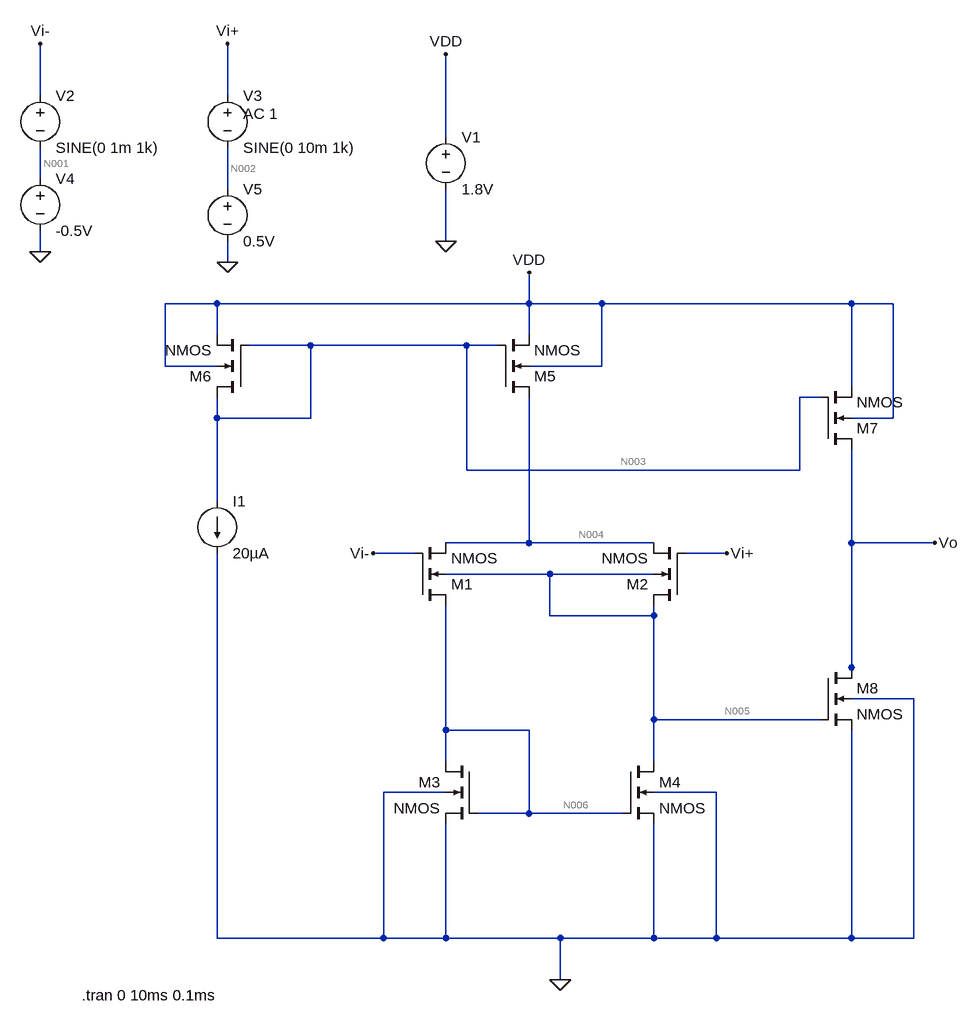
[diagram p0: schematic LAB3.asc]
LAB3.asc, the LTspice schematic file:
Version 4.1
SHEET 1 1288 1304
WIRE -160 -96 -160 -176
WIRE 128 -96 128 -176
WIRE 464 -32 464 -160
WIRE -160 32 -160 -16
WIRE 128 48 128 -16
WIRE 464 128 464 48
WIRE -160 144 -160 112
WIRE 128 160 128 128
WIRE 112 224 32 224
WIRE 592 224 592 176
WIRE 592 224 112 224
WIRE 704 224 592 224
WIRE 1088 224 704 224
WIRE 1152 224 1088 224
WIRE 112 272 112 224
WIRE 592 272 592 224
WIRE 256 288 160 288
WIRE 496 288 256 288
WIRE 544 288 496 288
WIRE 32 320 32 224
WIRE 112 320 32 320
WIRE 704 320 704 224
WIRE 704 320 592 320
WIRE 1088 352 1088 224
WIRE 1040 368 1008 368
WIRE 112 400 112 368
WIRE 256 400 256 288
WIRE 256 400 112 400
WIRE 1152 400 1152 224
WIRE 1152 400 1088 400
WIRE 496 480 496 288
WIRE 1008 480 1008 368
WIRE 1008 480 496 480
WIRE 112 528 112 400
WIRE 592 592 592 368
WIRE 592 592 464 592
WIRE 784 592 592 592
WIRE 1088 592 1088 448
WIRE 1216 592 1088 592
WIRE 416 608 352 608
WIRE 896 608 832 608
WIRE 624 640 464 640
WIRE 784 640 624 640
WIRE 624 704 624 640
WIRE 784 704 784 688
WIRE 784 704 624 704
WIRE 1088 784 1088 592
WIRE 1088 800 1088 784
WIRE 1184 832 1088 832
WIRE 784 864 784 704
WIRE 1040 864 784 864
WIRE 464 880 464 688
WIRE 592 880 464 880
WIRE 464 928 464 880
WIRE 784 928 784 864
WIRE 464 976 368 976
WIRE 880 976 784 976
WIRE 592 1008 592 880
WIRE 592 1008 512 1008
WIRE 736 1008 592 1008
WIRE 112 1200 112 608
WIRE 368 1200 368 976
WIRE 368 1200 112 1200
WIRE 464 1200 464 1024
WIRE 464 1200 368 1200
WIRE 640 1200 464 1200
WIRE 784 1200 784 1024
WIRE 784 1200 640 1200
WIRE 880 1200 880 976
WIRE 880 1200 784 1200
WIRE 1088 1200 1088 880
WIRE 1088 1200 880 1200
WIRE 1184 1200 1184 832
WIRE 1184 1200 1088 1200
WIRE 640 1264 640 1200
FLAG 464 128 0
FLAG 640 1264 0
FLAG 464 -160 VDD
FLAG -160 -176 Vi-
FLAG 128 -176 Vi+
FLAG 896 608 Vi+
FLAG 352 608 Vi-
FLAG 592 176 VDD
FLAG 1216 592 Vo
FLAG -160 144 0
FLAG 128 160 0
DATAFLAG 368 608 ""
DATAFLAG 784 800 ""
DATAFLAG 592 944 ""
DATAFLAG 400 288 ""
DATAFLAG 816 480 ""
DATAFLAG 592 528 ""
DATAFLAG 816 224 ""
DATAFLAG 864 608 ""
DATAFLAG 128 -144 ""
SYMBOL current 112 528 R0
WINDOW 123 0 0 Left 0
WINDOW 39 0 0 Left 0
SYMATTR InstName I1
SYMATTR Value 20µA
SYMBOL nmos4 416 688 M180
SYMATTR InstName M1
SYMATTR Value2 l=0.5u w=10u
SYMBOL nmos4 832 688 R180
SYMATTR InstName M2
SYMATTR Value2 l=0.5u w=10u
SYMBOL nmos4 512 928 M0
SYMATTR InstName M3
SYMATTR Value2 l=0.5u w=5u
SYMBOL nmos4 736 928 R0
SYMATTR InstName M4
SYMATTR Value2 l=0.5u w=5u
SYMBOL nmos4 544 368 M180
SYMATTR InstName M5
SYMATTR Value2 l=0.5u w=10u
SYMBOL nmos4 160 368 R180
SYMATTR InstName M6
SYMATTR Value2 l=0.5u w=10u
SYMBOL nmos4 1040 448 M180
SYMATTR InstName M7
SYMATTR Value2 l=0.5u w=10u
SYMBOL nmos4 1040 784 R0
SYMATTR InstName M8
SYMATTR Value2 l=0.5u w=10u
SYMBOL voltage 464 -48 R0
WINDOW 123 0 0 Left 0
WINDOW 39 0 0 Left 0
SYMATTR InstName V1
SYMATTR Value 1.8V
SYMBOL voltage -160 -112 R0
WINDOW 123 0 0 Left 0
WINDOW 39 0 0 Left 0
SYMATTR InstName V2
SYMATTR Value SINE(0 1m 1k)
SYMBOL voltage 128 -112 R0
WINDOW 123 24 44 Left 2
WINDOW 39 0 0 Left 0
SYMATTR Value2 AC 1
SYMATTR InstName V3
SYMATTR Value SINE(0 10m 1k)
SYMBOL voltage -160 16 R0
WINDOW 123 0 0 Left 0
WINDOW 39 0 0 Left 0
SYMATTR InstName V4
SYMATTR Value -0.5V
SYMBOL voltage 128 32 R0
WINDOW 123 0 0 Left 0
WINDOW 39 0 0 Left 0
SYMATTR InstName V5
SYMATTR Value 0.5V
TEXT -96 1288 Left 2 !.tran 0 10ms 0.1ms

The netlist it stands for:
* LAB3.asc
I1 N003 0 20µA
M1 N006 Vi- N004 N005 NMOS l=0.5u w=10u
M2 N005 Vi+ N004 N005 NMOS l=0.5u w=10u
M3 N006 N006 0 0 NMOS l=0.5u w=5u
M4 N005 N006 0 0 NMOS l=0.5u w=5u
M5 N004 N003 VDD VDD NMOS l=0.5u w=10u
M6 N003 N003 VDD VDD NMOS l=0.5u w=10u
M7 Vo N003 VDD VDD NMOS l=0.5u w=10u
M8 Vo N005 0 0 NMOS l=0.5u w=10u
V1 VDD 0 1.8V
V2 Vi- N001 SINE(0 1m 1k)
V3 Vi+ N002 SINE(0 10m 1k) AC 1
V4 N001 0 -0.5V
V5 N002 0 0.5V
.model NMOS NMOS
.model PMOS PMOS
.lib standard.mos
.tran 0 10ms 0.1ms
.backanno
.end

* Results of the author's LTspice run, read from the files saved beside the schematic
* Operating Point, zero values left out:
*   V(n006) = 37.29 mV
*   V(n004) = 1.357 V
*   V(n005) = 462.7 mV
*   V(vdd) = 1.8 V
*   V(n002) = 500 mV
*   V(n003) = 1.246 V
*   V(vi-) = -500 mV
*   V(vi+) = 500 mV
*   V(vo) = 1.226 V
*   V(n001) = -500 mV
*   I(I1) = 20 µA
*   Id(M4) = 139.1 nA
*   Is(M4) = -139.1 nA
*   Id(M5) = -278.1 nA
*   Ib(M5) = 278.1 nA
*   Id(M7) = -42.82 µA
*   Is(M7) = 77.18 nA
*   Ib(M7) = 42.74 µA
*   Id(M2) = -278.1 nA
*   Is(M2) = 278.1 nA
*   Id(M1) = -139.1 nA
*   Is(M1) = 2.223 pA
*   Ib(M1) = 139.1 nA
*   Id(M6) = -20 µA
*   Ib(M6) = 20 µA
*   I(V1) = -63.1 µA
*   Id(M3) = 139.1 nA
*   Is(M3) = -139.1 nA
*   Id(M8) = 42.82 µA
*   Is(M8) = -42.82 µA
*   Ib(M8) = -1.236 pA
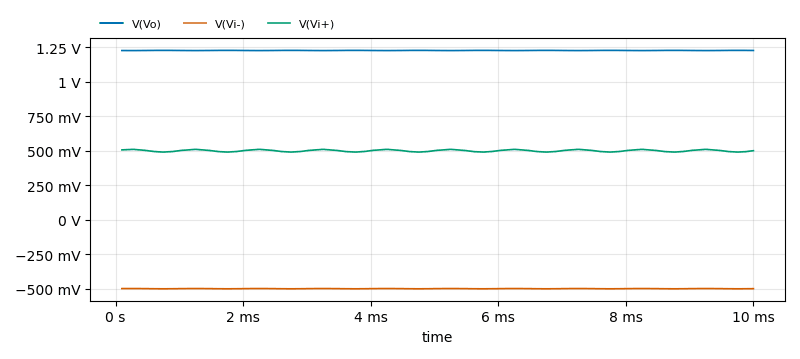
[diagram p1: Transient Analysis of LAB3.asc, plotted from the saved traces]
* Transient Analysis, 1 run:
*   V(Vo): min 1.226 V, max 1.227 V, average 1.226 V, rms 1.226 V, last 1.226 V
*   V(Vi-): min -501 mV, max -499 mV, average -500 mV, rms 500 mV, last -500 mV
*   V(Vi+): min 490 mV, max 509.8 mV, average 499.7 mV, rms 499.7 mV, last 500 mV